# Altium schematic sheet ai.SchDoc
size A2
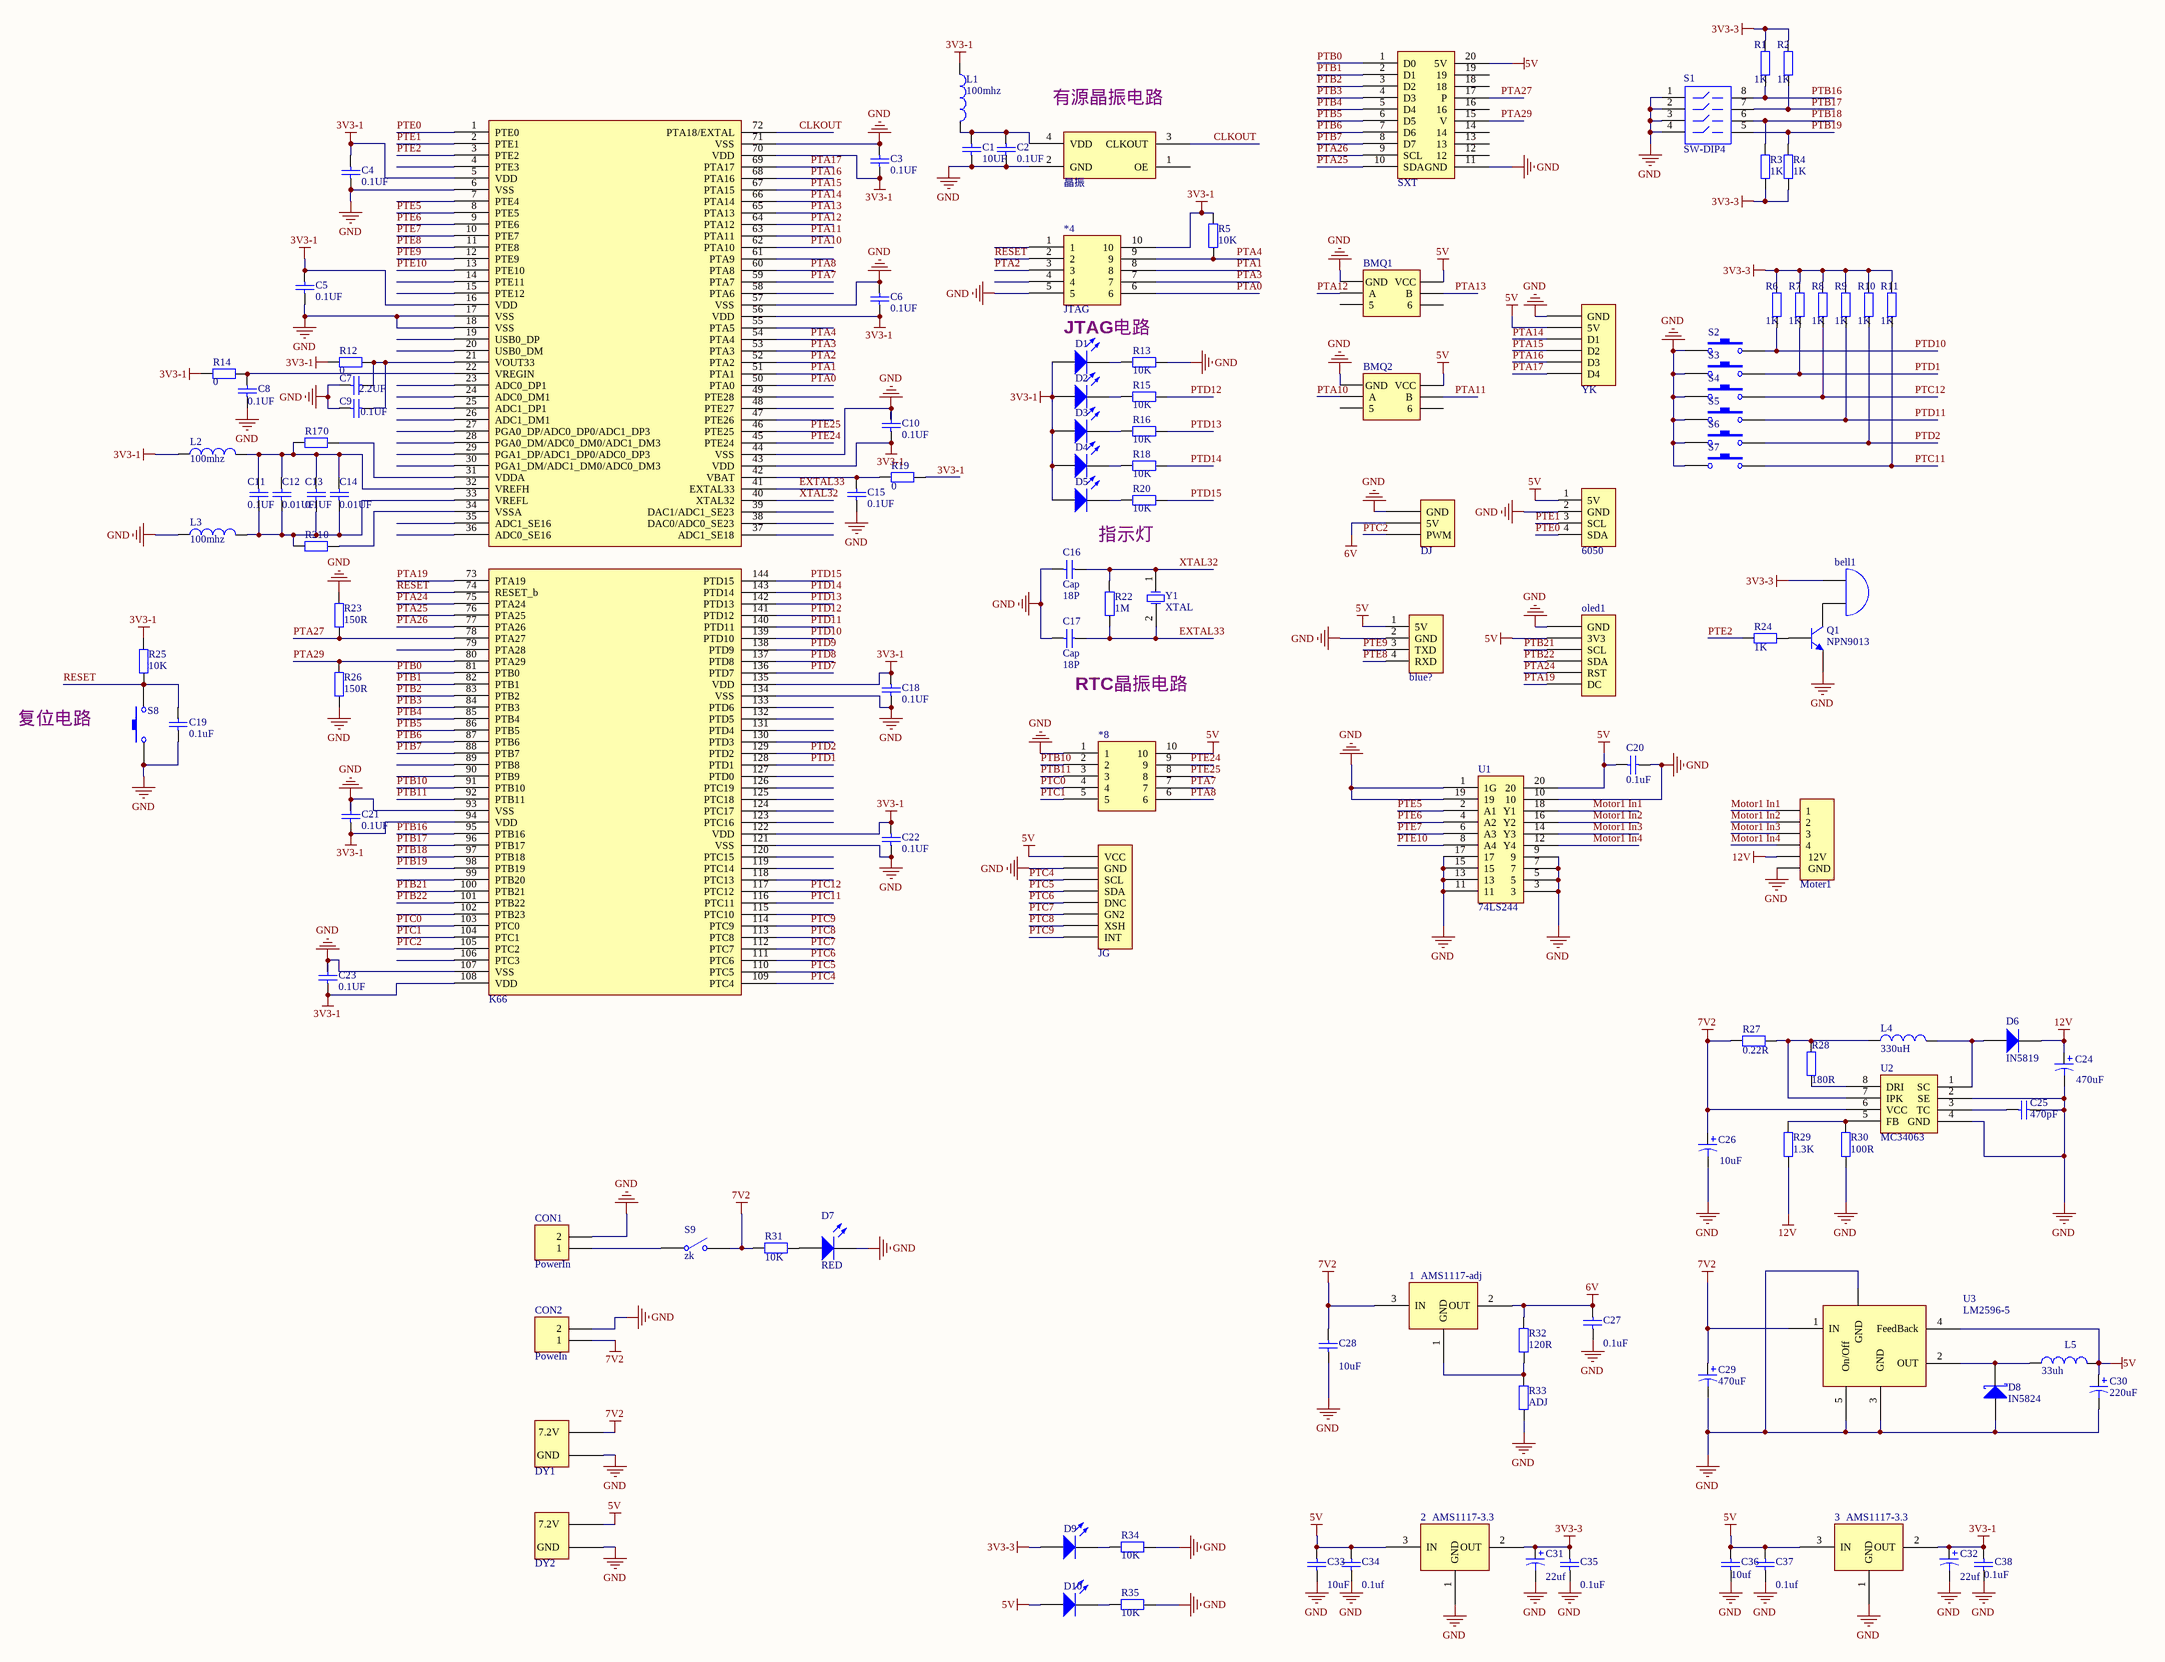
[diagram p0: ai.SchDoc]

## Parts
1  AMS1117-adj  [lm1117-5v]
2  AMS1117-3.3  [lm1117-5v]
3  AMS1117-3.3  [lm1117-5v]
*  6050  [HDR1X4]
*1  SXT  [SXT]
*2  K66  [LC-LQFP-144_20x20x05P]
*3  晶振  [LC-SMD-7050_4P]
*4  JTAG  [HDR2X5]
*5  YK  [HDR1X6]
*7  DJ  [HDR1X3]
*8  JTAG  [HDR2X5]  (value not drawn)
*9  JG  [HDR1X8]
bell1  Bell  [bezzer]  (value not drawn)
blue?  blueteeth2  [HDR1X4]  (value not drawn)
BMQ1  encode_1  [HDR2X3]  (value not drawn)
BMQ2  encode_2  [HDR2X3]  (value not drawn)
C1  value 10UF  [0603]  (hidden comment: Cap)
C2  value 0.1UF  [0603]  (hidden comment: Cap)
C3  value 0.1UF  [0603]  (hidden comment: Cap)
C4  value 0.1UF  [0603]  (hidden comment: Cap)
C5  value 0.1UF  [0603]  (hidden comment: Cap)
C6  value 0.1UF  [0603]  (hidden comment: Cap)
C7  value 2.2UF  [0603]  (hidden comment: Cap)
C8  value 0.1UF  [0603]  (hidden comment: Cap)
C9  value 0.1UF  [0603]  (hidden comment: Cap)
C10  value 0.1UF  [0603]  (hidden comment: Cap)
C11  value 0.1UF  [0603]  (hidden comment: Cap)
C12  value 0.01UF  [0603]  (hidden comment: Cap)
C13  value 0.1UF  [0603]  (hidden comment: Cap)
C14  value 0.01UF  [0603]  (hidden comment: Cap)
C15  value 0.1UF  [0603]  (hidden comment: Cap)
C16  Cap  value 18P  [0603]
C17  Cap  value 18P  [0603]
C18  value 0.1UF  [0603]  (hidden comment: Cap)
C19  value 0.1uF  [0603]  (hidden comment: Cap)
C20  0.1uF  [0805]
C21  value 0.1UF  [0603]  (hidden comment: Cap)
C22  value 0.1UF  [0603]  (hidden comment: Cap)
C23  value 0.1UF  [0603]  (hidden comment: Cap)
C24  470uF  [470UF]
C25  470pF  [0805]
C26  10uF  [0805]
C27  value 0.1uF  [0603]  (hidden comment: Cap)
C28  value 10uF  [0603]  (hidden comment: Cap)
C29  value 470uF  [470uf]  (hidden comment: Cap Pol1)
C30  value 220uF  [220uf]  (hidden comment: Cap Pol1)
C31  value 22uf  [0603]  (hidden comment: Cap Pol1)
C32  value 22uf  [0603]  (hidden comment: Cap Pol1)
C33  value 10uF  [0603]  (hidden comment: Cap)
C34  value 0.1uf  [0603]  (hidden comment: Cap)
C35  value 0.1uF  [0603]  (hidden comment: Cap)
C36  value 10uf  [0603]  (hidden comment: Cap)
C37  value 0.1uf  [0603]  (hidden comment: Cap)
C38  value 0.1uF  [0603]  (hidden comment: Cap)
CON1  PowerIn  [DIZUO]
CON2  PoweIn  [KF301-2P]
D1  LED0  [0805LED]  (value not drawn)
D2  LED0  [0805LED]  (value not drawn)
D3  LED0  [0805LED]  (value not drawn)
D4  LED0  [0805LED]  (value not drawn)
D5  LED0  [0805LED]  (value not drawn)
D6  IN5819  [0805LED]
D7  RED  [0805LED]
D8  IN5824  [1N5824]
D9  LED0  [0805LED]  (value not drawn)
D10  LED0  [0805LED]  (value not drawn)
DY1  H1  [HDR1X2]  (value not drawn)
DY2  H1  [HDR1X2]  (value not drawn)
L1  value 100mhz  [0603]  (hidden comment: Inductor)
L2  value 100mhz  [0603]  (hidden comment: Inductor)
L3  value 100mhz  [0603]  (hidden comment: Inductor)
L4  330uH  [diangan]
L5  value 33uh  [diangan]  (hidden comment: Inductor)
Moter1  Motor  [HDR1X6]  (value not drawn)
oled1  OLED  [HDR1X6]  (value not drawn)
Q1  NPN9013  [npn9013]
R1  value 1K  [0805]  (hidden comment: Res2)
R2  value 1K  [0805]  (hidden comment: Res2)
R3  value 1K  [0805]  (hidden comment: Res2)
R4  value 1K  [0805]  (hidden comment: Res2)
R5  value 10K  [0805]  (hidden comment: Res2)
R6  value 1K  [0805]  (hidden comment: Res2)
R7  value 1K  [0805]  (hidden comment: Res2)
R8  value 1K  [0805]  (hidden comment: Res2)
R9  value 1K  [0805]  (hidden comment: Res2)
R10  value 1K  [0805]  (hidden comment: Res2)
R11  value 1K  [0805]  (hidden comment: Res2)
R12  value 0  [0603]  (hidden comment: Res2)
R13  value 10K  [0805]  (hidden comment: Res2)
R14  value 0  [0603]  (hidden comment: Res2)
R15  value 10K  [0805]  (hidden comment: Res2)
R16  value 10K  [0805]  (hidden comment: Res2)
R17  value 0  [0603]  (hidden comment: Res2)
R18  value 10K  [0805]  (hidden comment: Res2)
R19  value 0  [0603]  (hidden comment: Res2)
R20  value 10K  [0805]  (hidden comment: Res2)
R21  value 0  [0603]  (hidden comment: Res2)
R22  value 1M  [0603]  (hidden comment: Res2)
R23  value 150R  [0603]  (hidden comment: Res2)
R24  value 1K  [0805]  (hidden comment: Res2)
R25  value 10K  [0603]  (hidden comment: Res2)
R26  value 150R  [0603]  (hidden comment: Res2)
R27  0.22R  [0603]
R28  180R  [0603]
R29  1.3K  [0603]
R30  100R  [0603]
R31  value 10K  [0805]  (hidden comment: Res2)
R32  value 120R  [0805]  (hidden comment: Res2)
R33  value ADJ  [1*2]  (hidden comment: Res2)
R34  value 10K  [0805]  (hidden comment: Res2)
R35  value 10K  [0805]  (hidden comment: Res2)
S1  SW-DIP4  [BMKG]
S2  SW-PB  [BUTTON]  (value not drawn)
S3  SW-PB  [BUTTON]  (value not drawn)
S4  SW-PB  [BUTTON]  (value not drawn)
S5  SW-PB  [BUTTON]  (value not drawn)
S6  SW-PB  [BUTTON]  (value not drawn)
S7  SW-PB  [BUTTON]  (value not drawn)
S8  SW-PB  [BUTTON]  (value not drawn)
S9  zk  [SWITCH-MID]
U1  74LS244  [74ls244DA]
U2  MC34063  [MC34063]
U3  LM2596-5  [LM2596]
Y1  XTAL  [32.768]

## Nets
3V3-1: 3.2(OUT) *2.5(VDD) *2.16(VDD) *2.43(VDD) *2.56(VDD) *2.70(VDD) *2.94(VDD) *2.108(VDD) *2.122(VDD) *2.135(VDD) *4.10 C3.1 C4.2 C5.2 C6.1 C10.1 C18.1 C21.1 C22.1 C23.1 C32.1 C38.2 D1.1(A) D2.1(A) D3.1(A) D4.1(A) D5.1(A) L1.1 L2.1 R5.2 R12.1 R14.1 R19.1 R25.1
3V3-3: 2.2(OUT) bell1.1(A) C31.1 C35.2 D9.1(A) R1.2 R2.2 R3.2 R4.1 R6.2 R7.2 R8.2 R9.2 R10.2 R11.2
5V: 2.3(IN) 3.3(IN) *.1(5V) *1.20(5V) *5.2(5V) *8.10 *9.1(VCC) blue?.1(5V) BMQ1.2(VCC) BMQ2.2(VCC) C20.2 C30.1 C33.2 C34.2 C36.2 C37.2 D10.1(A) DY2.2(7.2V) L5.2 oled1.2(3V3) U1.20 U3.4(FeedBack)
6V: 1.2(OUT) *7.2(5V) C27.2 R32.2
7V2: 1.3(IN) C26.1 C28.2 C29.1 CON2.1 DY1.2(7.2V) R27.2 R31.2 S9.2(NO) U2.6(VCC) U3.1(IN)
12V: C24.1 D6.2(K) Moter1.5(12V) R29.2
GND: 2.1(GND) 3.1(GND) *.2(GND) *1.11(GND) *2.6(VSS) *2.17(VSS) *2.18(VSS) *2.44(VSS) *2.57(VSS) *2.71(VSS) *2.93(VSS) *2.107(VSS) *2.121(VSS) *2.134(VSS) *3.2(GND) *4.5 *5.1(GND) *7.1(GND) *8.1 *9.2(GND) blue?.2(GND) BMQ1.1(GND) BMQ2.1(GND) C1.1 C2.1 C3.2 C4.1 C5.1 C6.2 C7.1 C8.1 C9.1 C10.2 C15.1 C16.1 C17.1 C18.2 C19.1 C20.1 C21.2 C22.2 C23.2 C24.2 C25.2 C26.2 C27.1 C28.1 C29.2 C30.2 C31.2 C32.2 C33.1 C34.1 C35.1 C36.1 C37.1 C38.1 CON1.2 CON2.2 D7.2(K) D8.2(K) DY1.1(GND) DY2.1(GND) L3.1 Moter1.6(GND) oled1.1(GND) Q1.1(E) R13.2 R23.2 R26.1 R30.2 R33.1 R34.2 R35.2 S1.1 S1.2 S1.3 S1.4 S2.1 S3.1 S4.1 S5.1 S6.1 S7.1 S8.1 U1.1(1G) U1.3 U1.5 U1.7 U1.9 U1.10 U1.11 U1.13 U1.15 U1.17 U1.19 U2.2(SE) U2.4(GND) U3.3(GND) U3.5(On/Off) U3.6(GND)
CLKOUT: *2.72(PTA18/EXTAL) *3.3(CLKOUT)
EXTAL33: *2.41(EXTAL33) C17.2 R22.1 Y1.2(OSC2)
Motor1 In1: Moter1.1 U1.18(Y1)
Motor1 In2: Moter1.2 U1.16(Y2)
Motor1 In3: Moter1.3 U1.14(Y3)
Motor1 In4: Moter1.4 U1.12(Y4)
PTA0: *2.50(PTA0) *4.6
PTA1: *2.51(PTA1) *4.8
PTA2: *2.52(PTA2) *4.3
PTA3: *2.53(PTA3) *4.7
PTA4: *2.54(PTA4) *4.9 R5.1
PTA7: *2.59(PTA7) *8.7
PTA8: *2.60(PTA8) *8.6
PTA10: *2.62(PTA10) BMQ2.3(A)
PTA11: *2.63(PTA11) BMQ2.4(B)
PTA12: *2.64(PTA12) BMQ1.3(A)
PTA13: *2.65(PTA13) BMQ1.4(B)
PTA14: *2.66(PTA14) *5.3(D1)
PTA15: *2.67(PTA15) *5.4(D2)
PTA16: *2.68(PTA16) *5.5(D3)
PTA17: *2.69(PTA17) *5.6(D4)
PTA19: *2.73(PTA19) oled1.6(DC)
PTA24: *2.75(PTA24) oled1.5(RST)
PTA25: *1.10(SDA) *2.76(PTA25)
PTA26: *1.9(SCL) *2.77(PTA26)
PTA27: *1.17(P) *2.78(PTA27) R23.1
PTA29: *1.15(V) *2.80(PTA29) R26.2
PTB0: *1.1(D0) *2.81(PTB0)
PTB1: *1.2(D1) *2.82(PTB1)
PTB2: *1.3(D2) *2.83(PTB2)
PTB3: *1.4(D3) *2.84(PTB3)
PTB4: *1.5(D4) *2.85(PTB4)
PTB5: *1.6(D5) *2.86(PTB5)
PTB6: *1.7(D6) *2.87(PTB6)
PTB7: *1.8(D7) *2.88(PTB7)
PTB10: *2.91(PTB10) *8.2
PTB11: *2.92(PTB11) *8.3
PTB16: *2.95(PTB16) R1.1 S1.8
PTB17: *2.96(PTB17) R2.1 S1.7
PTB18: *2.97(PTB18) R3.1 S1.6
PTB19: *2.98(PTB19) R4.2 S1.5
PTB21: *2.100(PTB21) oled1.3(SCL)
PTB22: *2.101(PTB22) oled1.4(SDA)
PTC0: *2.103(PTC0) *8.4
PTC1: *2.104(PTC1) *8.5
PTC2: *2.105(PTC2) *7.3(PWM)
PTC4: *2.109(PTC4) *9.3(SCL)
PTC5: *2.110(PTC5) *9.4(SDA)
PTC6: *2.111(PTC6) *9.5(DNC)
PTC7: *2.112(PTC7) *9.6(GN2)
PTC8: *2.113(PTC8) *9.7(XSH)
PTC9: *2.114(PTC9) *9.8(INT)
PTC11: *2.116(PTC11) R11.1 S7.2
PTC12: *2.117(PTC12) R8.1 S4.2
PTD1: *2.128(PTD1) R7.1 S3.2
PTD2: *2.129(PTD2) R10.1 S6.2
PTD7: *2.136(PTD7)
PTD8: *2.137(PTD8)
PTD9: *2.138(PTD9)
PTD10: *2.139(PTD10) R6.1 S2.2
PTD11: *2.140(PTD11) R9.1 S5.2
PTD12: *2.141(PTD12) R15.2
PTD13: *2.142(PTD13) R16.2
PTD14: *2.143(PTD14) R18.2
PTD15: *2.144(PTD15) R20.2
PTE0: *.4(SDA) *2.1(PTE0)
PTE1: *.3(SCL) *2.2(PTE1)
PTE2: *2.3(PTE2) R24.1
PTE5: *2.8(PTE5) U1.2(A1)
PTE6: *2.9(PTE6) U1.4(A2)
PTE7: *2.10(PTE7) U1.6(A3)
PTE8: *2.11(PTE8) blue?.4(RXD)
PTE9: *2.12(PTE9) blue?.3(TXD)
PTE10: *2.13(PTE10) U1.8(A4)
PTE24: *2.45(PTE24) *8.9
PTE25: *2.46(PTE25) *8.8
RESET: *2.74(RESET_b) *4.2 C19.2 R25.2 S8.2
XTAL32: *2.40(XTAL32) C16.2 R22.2 Y1.1(OSC1)
Net1_1: 1.1(GND) R32.1 R33.2
Net*2_21: *2.21(VOUT33) C7.2 C9.2 R12.2
Net*2_22: *2.22(VREGIN) C8.2 R14.2
Net*2_31: *2.31(VDDA) R17.2
Net*2_32: *2.32(VREFH) C11.2 C12.2 C13.2 C14.2 L2.2 R17.1
Net*2_33: *2.33(VREFL) C11.1 C12.1 C13.1 C14.1 L3.2 R21.1
Net*2_34: *2.34(VSSA) R21.2
Net*2_42: *2.42(VBAT) C15.2 R19.2
Net*3_4: *3.4(VDD) C1.2 C2.2 L1.2
Netbell1_2: bell1.2(B) Q1.3(C)
NetC25_1: C25.1 U2.3(TC)
NetCON1_1: CON1.1 S9.1(COMMON)
NetD1_2: D1.2(K) R13.1
NetD2_2: D2.2(K) R15.1
NetD3_2: D3.2(K) R16.1
NetD4_2: D4.2(K) R18.1
NetD5_2: D5.2(K) R20.1
NetD6_1: D6.1(A) L4.2 U2.1(SC)
NetD7_1: D7.1(A) R31.1
NetD8_1: D8.1(A) L5.1 U3.2(OUT)
NetD9_2: D9.2(K) R34.1
NetD10_2: D10.2(K) R35.1
NetL4_1: L4.1 R27.1 R28.2 U2.7(IPK)
NetQ1_2: Q1.2(B) R24.2
NetR28_1: R28.1 U2.8(DRI)
NetR29_1: R29.1 R30.1 U2.5(FB)

Not connected (* = marked no-connect by the designer): *1 12 13 14 16 18 19; *2 4(PTE3) 7(PTE4) 14(PTE11) 15(PTE12) 19(USB0_DP) 20(USB0_DM) 23(ADC0_DP1) 24(ADC0_DM1) 25(ADC1_DP1) 26(ADC1_DM1) 27(PGA0_DP/ADC0_DP0/ADC1_DP3) 28(PGA0_DM/ADC0_DM0/ADC1_DM3) 29(PGA1_DP/ADC1_DP0/ADC0_DP3) 30(PGA1_DM/ADC1_DM0/ADC0_DM3) 35(ADC1_SE16) 36(ADC0_SE16) 37(ADC1_SE18) 38(DAC0/ADC0_SE23) 39(DAC1/ADC1_SE23) 47(PTE26) 48(PTE27) 49(PTE28) 55(PTA5) 58(PTA6) 61(PTA9) 79(PTA28) 89(PTB8) 90(PTB9) 99(PTB20) 102(PTB23) 106(PTC3) 115(PTC10) 118(PTC13) 119(PTC14) 120(PTC15) 123(PTC16) 124(PTC17) 125(PTC18) 126(PTC19) 127(PTD0) 130(PTD3) 131(PTD4) 132(PTD5) 133(PTD6); *3 1(OE); *4 1 4; BMQ1 5 6; BMQ2 5 6

## Notes on the sheet
- (near *3) 有源晶振电路
- JTAG电路
- 指示灯
- 复位电路
- RTC晶振电路

## Library data of the parts
1-3 = LT1117-3.3
*1 = 摄像头
*5 = 遥控
*7 = 舵机
*9 = 激光
bell1 = Bell: Electrical Bell; Published: 24-Mar-1999; LatestRevisionDate: 17-Jul-2002; LatestRevisionNote: Re-released for DXP Platform.; PackageReference: PIN2; Publisher: Altium Limited
blue? = blueteeth
BMQ1 BMQ2 = encode
C1-C19 C21-C23 C27 C28 C33-C38 = Cap: Capacitor; Published: 8-Jun-2000; LatestRevisionDate: 17-Jul-2002; LatestRevisionNote: Re-released for DXP Platform.; PackageReference: RAD-0.3; Publisher: Altium Limited; PackageDescription: Radial Cap, Thru-Hole; 2 Leads; 0.3 in Pin Spacing
C20 C25 = Cap Semi: Capacitor (Semiconductor SIM Model); Published: 8-Jun-2000; LatestRevisionDate: 29-May-2009; LatestRevisionNote: IPC-7351 Footprint Added.; PackageReference: C1206; Publisher: Altium Limited; PackageDescription: Chip Capacitor
  C20: Value: 0.1uF
  C25: Value: 470pF
C24 C26 = Cap Pol3: Polarized Capacitor (Surface Mount); Published: 8-Jun-2000; LatestRevisionDate: 29-May-2009; LatestRevisionNote: IPC-7351 Footprint Added.; PackageReference: C0805; Publisher: Altium Limited; PackageDescription: Chip Capacitor
  C24: Value: 470uF
  C26: Value: 10uF
C29-C32 = Cap Pol1: Polarized Capacitor (Radial); Published: 8-Jun-2000; LatestRevisionDate: 17-Jul-2002; LatestRevisionNote: Re-released for DXP Platform.; PackageReference: RB7.6-15; Publisher: Altium Limited; PackageDescription: Polarized Capacitor (Radial); 2 Leads
CON1 CON2 = Header 2: Header, 2-Pin; LatestRevisionDate: 17-Jul-2002; LatestRevisionNote: Re-released for DXP Platform.; Publisher: Altium Limited
D1-D5 D9 D10 = LED0: Typical INFRARED GaAs LED; Published: 8-Jun-2000; LatestRevisionDate: 08-Jul-2005; LatestRevisionNote: Mech Layer 1 removed.; PackageReference: LED-0; Publisher: Altium Limited; PackageDescription: LED; 2 Leads
D6 = Diode: Default Diode; Published: 8-Jun-2000; LatestRevisionDate: 17-Jul-2002; LatestRevisionNote: Re-released for DXP Platform.; PackageVersion: Sep-1996; PackageReference: SMC; Publisher: Altium Limited; PackageDescription: DO-214-AB/SMC; 2 C-Bend Leads; Body 7.9 x 5.9 mm, inc. leads (LxW); Code_JEDEC: DO-214-AB
D7 = LED2: Typical RED, GREEN, YELLOW, AMBER GaAs LED; Published: 8-Jun-2000; LatestRevisionDate: 17-Jul-2002; LatestRevisionNote: Re-released for DXP Platform.; PackageVersion: Feb-2002; PackageReference: 3.2X1.6X1.1; Publisher: Altium Limited; PackageDescription: SM LED; 2 Flat Leads
L1-L5 = Inductor: Code_IEC: 1005; Published: 8-Jun-2000; LatestRevisionDate: 29-May-2009; LatestRevisionNote: IPC-7351 Footprint Added.; PackageReference: 0402-A; Publisher: Altium Limited; PackageDescription: Chip Inductor; Code_JEITA: 0402
  L4: Value: 330uH
Q1 = 2N3904: NPN General Purpose Amplifier; Published: 8-Jun-2000; LatestRevisionDate: 15-Jan-2003; LatestRevisionNote: PCB Footprint 'BCY-W3/D4.7' replaced; DatasheetVersion: 1997; PackageVersion: Sep-1998; PackageReference: TO-92A; Publisher: Altium Limited; PackageDescription: TO, Flat Index; 3 In-Line, Axial Leads; Body Dia. 4.5mm; Leads 0.51 x 0.48 mm (max); ComponentLink1Description: Manufacturer Link; ComponentLink1URL: http://www.fairchildsemi.com/; ComponentLink2Description: Datasheet; ComponentLink2URL: http://www.fairchildsemi.com/ds/2N%2F2N3904.pdf
R1-R35 = Res2: Resistor; Published: 8-Jun-2000; LatestRevisionDate: 17-Jul-2002; LatestRevisionNote: Re-released for DXP Platform.; PackageReference: AXIAL-0.4; Publisher: Altium Limited; PackageDescription: Axial Device, Thru-Hole; 2 Leads; 0.4 in Pin Spacing
  R27: Value: 0.22R
  R28: Value: 180R
  R29: Value: 1.3K
  R30: Value: 100R
S1 = SW-DIP4: DIP Switch; Published: 24-Mar-1999; LatestRevisionDate: 17-Jul-2002; LatestRevisionNote: Re-released for DXP Platform.; PackageReference: DIP-8; Publisher: Altium Limited
S2-S7 = SW-PB: Switch; Published: 24-Mar-1999; LatestRevisionDate: 17-Jul-2002; LatestRevisionNote: Re-released for DXP Platform.; PackageReference: SPST-2; Publisher: Altium Limited; PackageDescription: Switch; 2 Leads
S8 = SW-PB: 按键; Published: 24-Mar-1999; LatestRevisionDate: 17-Jul-2002; LatestRevisionNote: Re-released for DXP Platform.; PackageReference: SPST-2; Publisher: Altium Limited; PackageDescription: Switch; 2 Leads
S9 = SW-SPST: Single-Pole, Single-Throw Switch; Published: 24-Mar-1999; LatestRevisionDate: 17-Jul-2002; LatestRevisionNote: Re-released for DXP Platform.; PackageReference: SPST-2; Publisher: Altium Limited; PackageDescription: Switch; 2 Leads
U3 = LM2596
Y1 = XTAL: Crystal Oscillator; Published: 8-Jun-2000; LatestRevisionDate: 17-Jul-2002; LatestRevisionNote: Re-released for DXP Platform.; PackageReference: R38; Publisher: Altium Limited; PackageDescription: Crystal, Thru-Hole; 2 Leads; Body 3.1 x 8.2 mm (Dia.xH)